# Altium schematic sheet BrauV2_TopLevel.SchDoc
size 420 x 297 mm; PageSetup: Record=PageOptions|CenterHorizontal=True|CenterVertical=True|PrintScale=1.01|XCorrection=1.00|YCorrection=1.00|PrintKind=1|BorderSize=5000000|LeftOffset=0|BottomOffset=0|Orientation=2|PaperLength=1000|PaperWidth=1000|Scale=100|PaperSource=7|PrintQuality=-4|MediaType=1|DitherType=10|PaperKind=A3|PrintScaleMode=1; Author: Callum Nunes-Vaz; DocumentNumber: 1; SheetNumber: 1; SheetTotal: 22; SheetTitle: Top Level
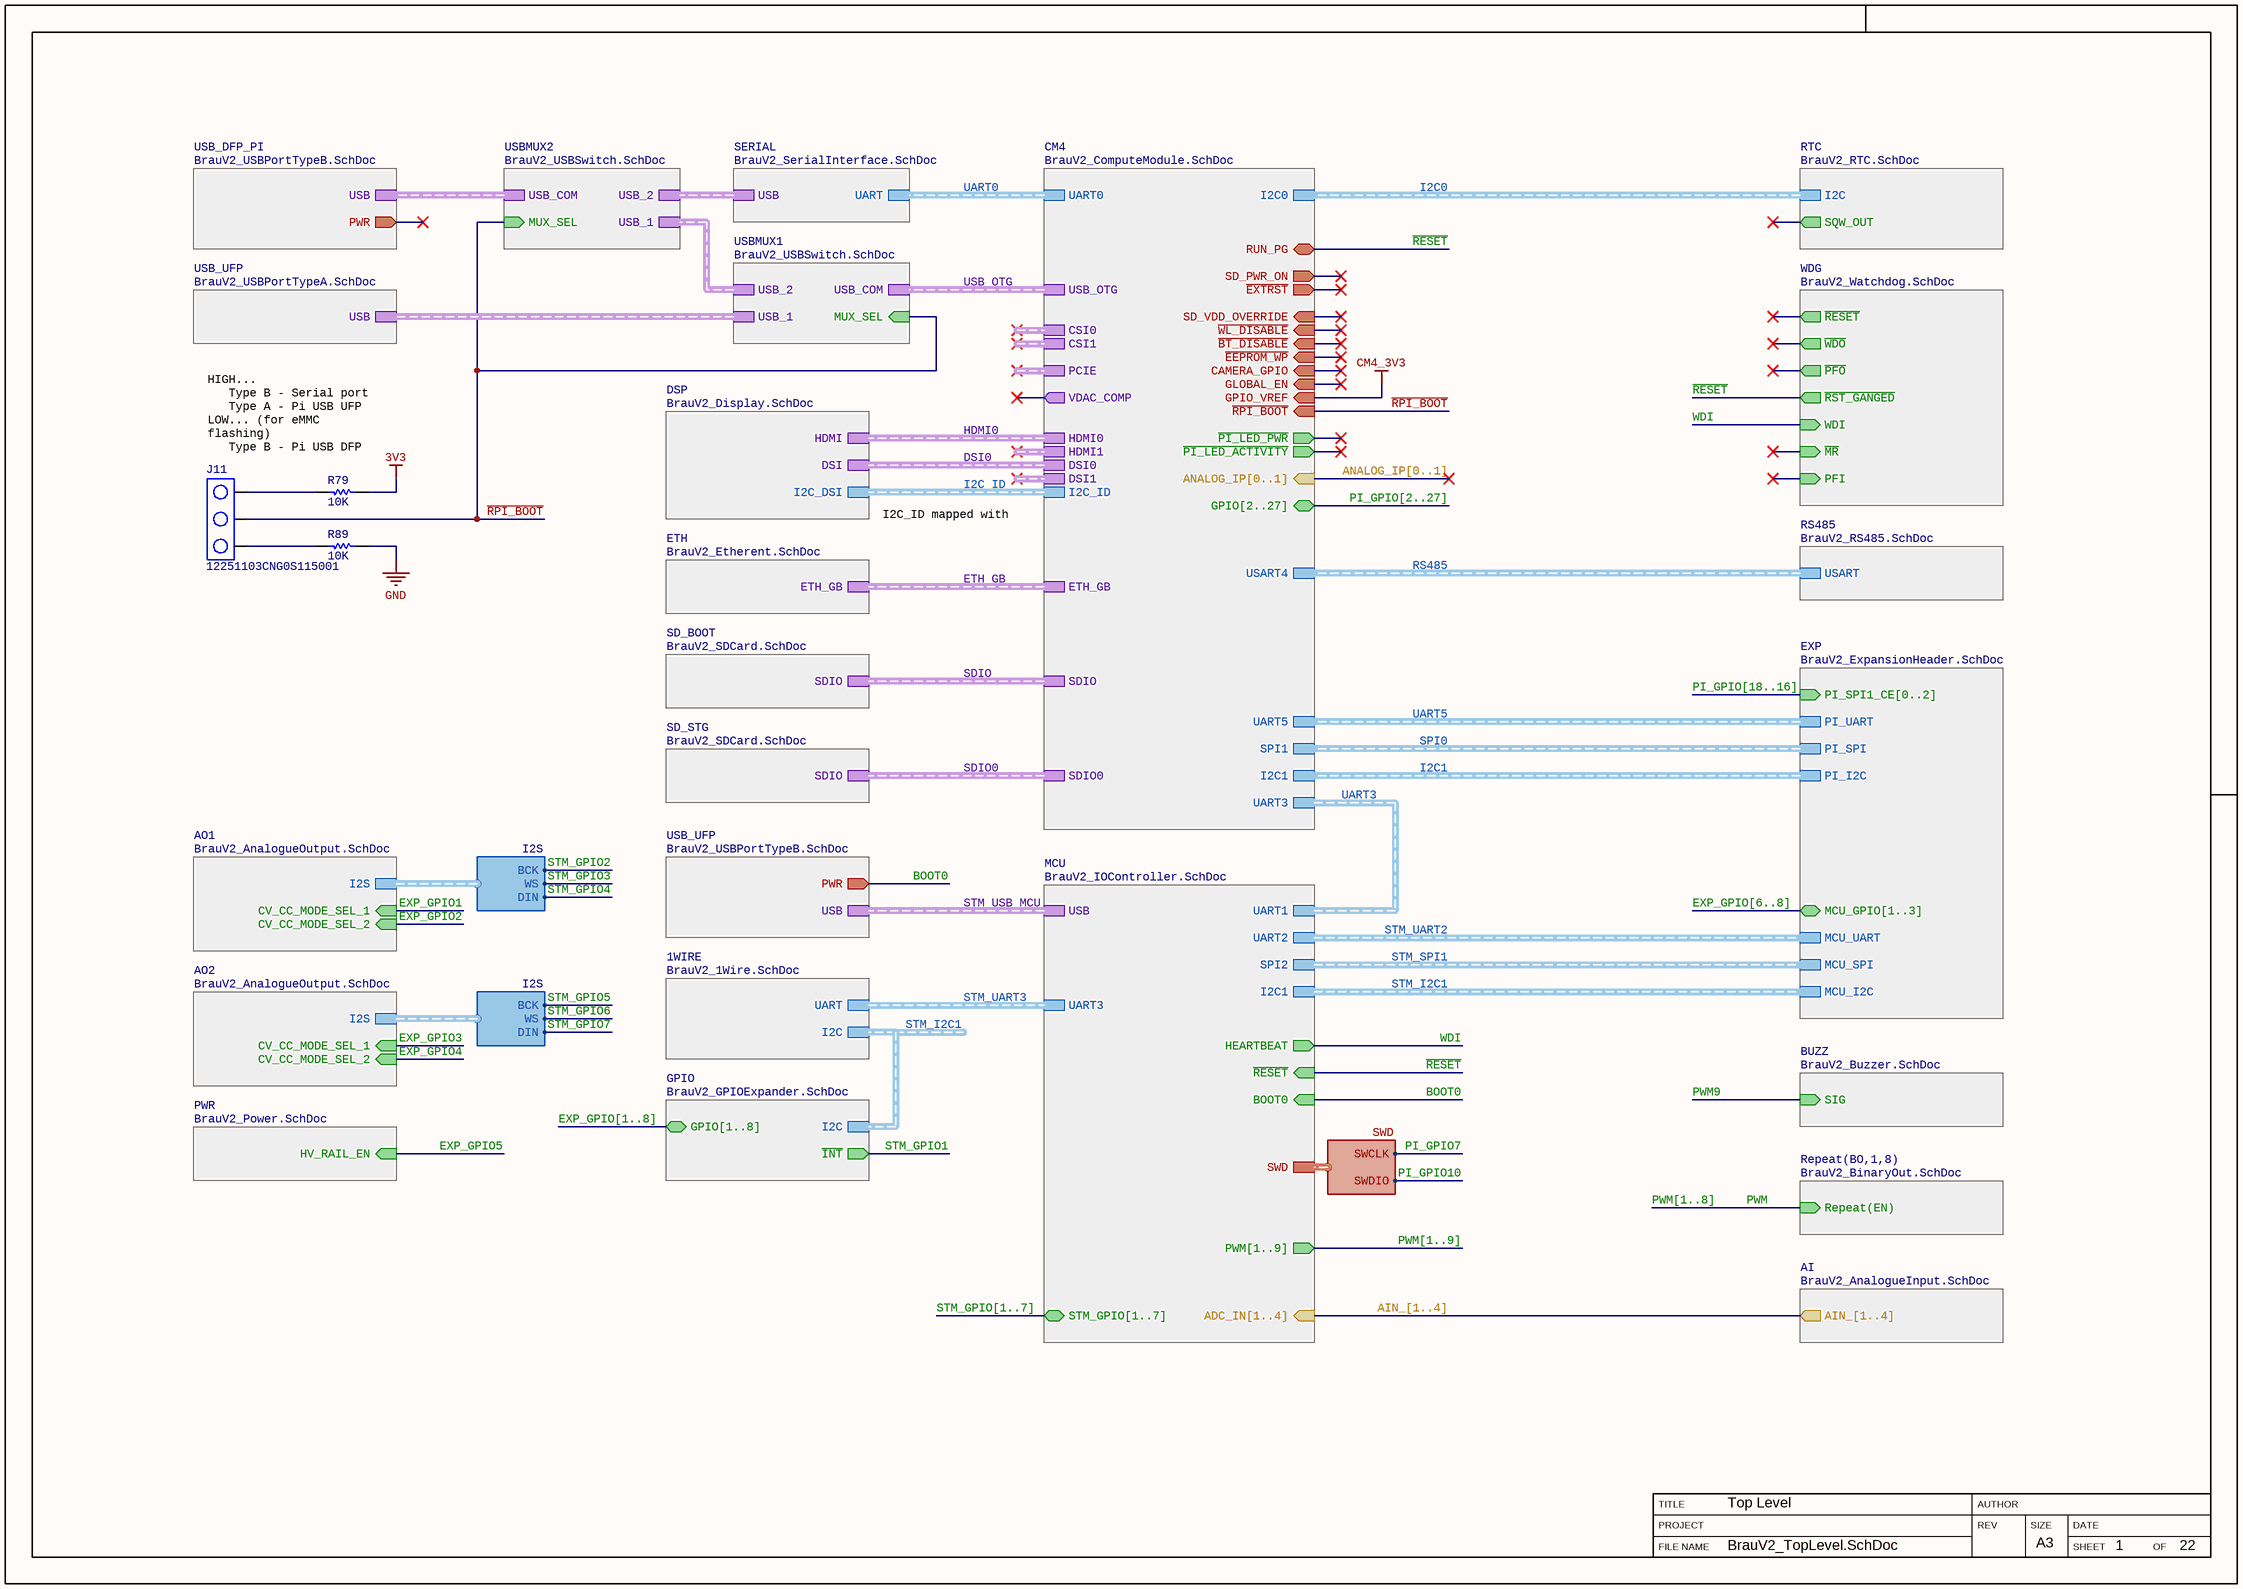
[diagram p0: BrauV2_TopLevel.SchDoc]

## Parts
J11  12251103CNG0S115001  [Header_3POS]
R79  Resistance: 10K  [SMD_RES_0402(1005)_N]  (hidden comment: RC0402FR-0710KL)
R89  Resistance: 10K  [SMD_RES_0402(1005)_N]  (hidden comment: RC0402FR-0710KL)

## Sub-sheets
1WIRE = BrauV2_1Wire.SchDoc: I2C (harness I2C), UART (harness UART)
AI = BrauV2_AnalogueInput.SchDoc: AIN_[1..4] (out)
AO1 = BrauV2_AnalogueOutput.SchDoc: CV_CC_MODE_SEL_1 (in), I2S (harness I2S), CV_CC_MODE_SEL_2 (in)
AO2 = BrauV2_AnalogueOutput.SchDoc: CV_CC_MODE_SEL_1 (in), I2S (harness I2S), CV_CC_MODE_SEL_2 (in)
BUZZ = BrauV2_Buzzer.SchDoc: SIG (in)
CM4 = BrauV2_ComputeModule.SchDoc: ANALOG_IP[0..1] (in), USB_OTG (harness USB), I2C1 (harness I2C), VDAC_COMP (out), PCIE (harness PCIE), CSI1 (harness MIPI_CSI_4L), CSI0 (harness MIPI_CSI_2L), GPIO[2..27] (bidir), RUN_PG (bidir), HDMI0 (harness HDMI), DSI0 (harness MIPI_DSI_2L), SDIO (harness SDIO_X8), HDMI1 (harness HDMI), ETH_GB (harness ETH_GP), DSI1 (harness MIPI_DSI_4L), I2C_ID (harness I2C), UART0 (harness UART), UART3 (harness UART), I2C0 (harness I2C), SDIO0 (harness SDIO_X8), UART5 (harness UART), SPI1 (harness SPI), USART4 (harness USART), SD_PWR_ON (out), ~{EXTRST} (out), GLOBAL_EN (in), ~{RPI_BOOT} (in), CAMERA_GPIO (in), ~{WL_DISABLE} (in), ~{EEPROM_WP} (in), ~{BT_DISABLE} (in), SD_VDD_OVERRIDE (in), GPIO_VREF (in), ~{PI_LED_ACTIVITY} (out), ~{PI_LED_PWR} (out)
DSP = BrauV2_Display.SchDoc: I2C_DSI (harness I2C), HDMI (harness HDMI), DSI (harness MIPI_DSI_4L)
ETH = BrauV2_Etherent.SchDoc: ETH_GB (harness ETH_GP)
EXP = BrauV2_ExpansionHeader.SchDoc: MCU_I2C (harness I2C), MCU_UART (harness UART), MCU_SPI (harness SPI), PI_SPI1_CE[0..2] (in), PI_I2C (harness I2C), PI_UART (harness UART), PI_SPI (harness SPI), MCU_GPIO[1..3] (bidir)
GPIO = BrauV2_GPIOExpander.SchDoc: I2C (harness I2C), GPIO[1..8] (bidir), ~{INT} (out)
MCU = BrauV2_IOController.SchDoc: ADC_IN[1..4] (in), STM_GPIO[1..7] (bidir), UART1 (harness UART), UART2 (harness UART), SPI2 (harness SPI), SWD (harness SWD), PWM[1..9] (out), BOOT0 (in), USB (harness USB), UART3 (harness UART), I2C1 (harness I2C), ~{RESET} (in), HEARTBEAT (out)
PWR = BrauV2_Power.SchDoc: HV_RAIL_EN (in)
Repeat(BO,1,8) = BrauV2_BinaryOut.SchDoc: Repeat(EN) (in)
RS485 = BrauV2_RS485.SchDoc: USART (harness USART)
RTC = BrauV2_RTC.SchDoc: SQW_OUT (out), I2C (harness I2C)
SD_BOOT = BrauV2_SDCard.SchDoc: SDIO (harness SDIO_X8)
SD_STG = BrauV2_SDCard.SchDoc: SDIO (harness SDIO_X8)
SERIAL = BrauV2_SerialInterface.SchDoc: UART (harness UART), USB (harness USB)
USB_DFP_PI = BrauV2_USBPortTypeB.SchDoc: USB (harness USB), PWR (out)
USB_UFP = BrauV2_USBPortTypeA.SchDoc: USB (harness USB)
USB_UFP = BrauV2_USBPortTypeB.SchDoc: USB (harness USB), PWR (out)
USBMUX1 = BrauV2_USBSwitch.SchDoc: USB_COM (harness USB), USB_1 (harness USB), USB_2 (harness USB), MUX_SEL (in)
USBMUX2 = BrauV2_USBSwitch.SchDoc: USB_COM (harness USB), USB_1 (harness USB), USB_2 (harness USB), MUX_SEL (in)
WDG = BrauV2_Watchdog.SchDoc: PFI (in), ~{MR} (in), WDI (in), ~{PFO} (out), ~{WDO} (out), ~{RESET} (out), ~{RST_GANGED} (out)

## Harnesses
SWD: SWCLK, SWDIO
I2S: WS, BCK, DIN

## Nets
3V3: R79.2
CM4_3V3: sheet CM4/GPIO_VREF
GND: R89.1
BOOT0: sheet MCU/BOOT0, sheet USB_UFP/PWR
EXP_GPIO1: sheet AO1/CV_CC_MODE_SEL_1
EXP_GPIO2: sheet AO1/CV_CC_MODE_SEL_2
EXP_GPIO3: sheet AO2/CV_CC_MODE_SEL_1
EXP_GPIO4: sheet AO2/CV_CC_MODE_SEL_2
EXP_GPIO5: sheet PWR/HV_RAIL_EN
PI_GPIO7: sheet MCU/SWD.SWCLK
PI_GPIO10: sheet MCU/SWD.SWDIO
PWM: sheet Repeat(BO,1,8)/Repeat(EN)
PWM9: sheet BUZZ/SIG
~{RESET}: sheet CM4/RUN_PG, sheet MCU/~{RESET}, sheet WDG/~{RST_GANGED}
~{RPI_BOOT}: J11.2 ; sheet CM4/~{RPI_BOOT}, sheet USBMUX1/MUX_SEL, sheet USBMUX2/MUX_SEL
STM_GPIO1: sheet GPIO/~{INT}
STM_GPIO2: sheet AO1/I2S.BCK
STM_GPIO3: sheet AO1/I2S.WS
STM_GPIO4: sheet AO1/I2S.DIN
STM_GPIO5: sheet AO2/I2S.BCK
STM_GPIO6: sheet AO2/I2S.WS
STM_GPIO7: sheet AO2/I2S.DIN
WDI: sheet MCU/HEARTBEAT, sheet WDG/WDI
NetJ11_1: J11.1 R79.1
NetJ11_3: J11.3 R89.2

## Buses and harness runs
bus AIN_[1..4] = sheet AI/AIN_[1..4] = sheet MCU/ADC_IN[1..4]
bus ANALOG_IP[0..1] = sheet CM4/ANALOG_IP[0..1]
bus EXP_GPIO[1..8] = sheet GPIO/GPIO[1..8]
bus EXP_GPIO[6..8] = sheet EXP/MCU_GPIO[1..3]
bus PI_GPIO[2..27] = sheet CM4/GPIO[2..27]
bus PI_GPIO[18..16] = sheet EXP/PI_SPI1_CE[0..2]
bus PWM[1..8]
bus PWM[1..9] = sheet MCU/PWM[1..9]
bus STM_GPIO[1..7] = sheet MCU/STM_GPIO[1..7]
harness DSI0 = sheet CM4/DSI0 = sheet DSP/DSI
harness ETH_GB = sheet CM4/ETH_GB = sheet ETH/ETH_GB
harness HDMI0 = sheet CM4/HDMI0 = sheet DSP/HDMI
harness I2C0 = sheet CM4/I2C0 = sheet RTC/I2C
harness I2C1 = sheet CM4/I2C1 = sheet EXP/PI_I2C
harness I2C_ID = sheet CM4/I2C_ID = sheet DSP/I2C_DSI
harness RS485 = sheet CM4/USART4 = sheet RS485/USART
harness SDIO0 = sheet CM4/SDIO0 = sheet SD_STG/SDIO
harness SDIO = sheet CM4/SDIO = sheet SD_BOOT/SDIO
harness sheet SERIAL/USB = sheet USBMUX2/USB_2
harness sheet USB_DFP_PI/USB = sheet USBMUX2/USB_COM
harness sheet USB_UFP/USB = sheet USBMUX1/USB_1
harness sheet USBMUX1/USB_2 = sheet USBMUX2/USB_1
harness SPI0 = sheet CM4/SPI1 = sheet EXP/PI_SPI
harness STM_I2C1 = sheet 1WIRE/I2C = sheet GPIO/I2C
harness STM_I2C1 = sheet EXP/MCU_I2C = sheet MCU/I2C1
harness STM_SPI1 = sheet EXP/MCU_SPI = sheet MCU/SPI2
harness STM_UART2 = sheet EXP/MCU_UART = sheet MCU/UART2
harness STM_UART3 = sheet 1WIRE/UART = sheet MCU/UART3
harness STM_USB_MCU = sheet MCU/USB = sheet USB_UFP/USB
harness UART0 = sheet CM4/UART0 = sheet SERIAL/UART
harness UART3 = sheet CM4/UART3 = sheet MCU/UART1
harness UART5 = sheet CM4/UART5 = sheet EXP/PI_UART
harness USB_OTG = sheet CM4/USB_OTG = sheet USBMUX1/USB_COM

## Notes on the sheet
- HIGH...
  Type B - Serial port
  Type A - Pi USB UFP
  LOW... (for eMMC flashing)
  Type B - Pi USB DFP
  Type A - disconnected
- I2C_ID mapped with DSI0
- FILE NAME
- PROJECT
- TITLE
- REV
- AUTHOR
- SIZE
- SHEET
- DATE
- OF
- A3

## Library data of the parts
J11 = 3-way Jumper: Pin Header 3 1 right-angle，180degrees 2.54mm Through Hole,P=2.54mm Pin Header & Female Header RoHS
R79 R89 = 10K 0402 1% 1/16W: 10kΩ ±1% 1/16W ±100ppm/℃ 0402 Chip Resistor - Surface Mount RoHS; Package: 0402; Tolerance: 1%; Power Rating: 1/16W